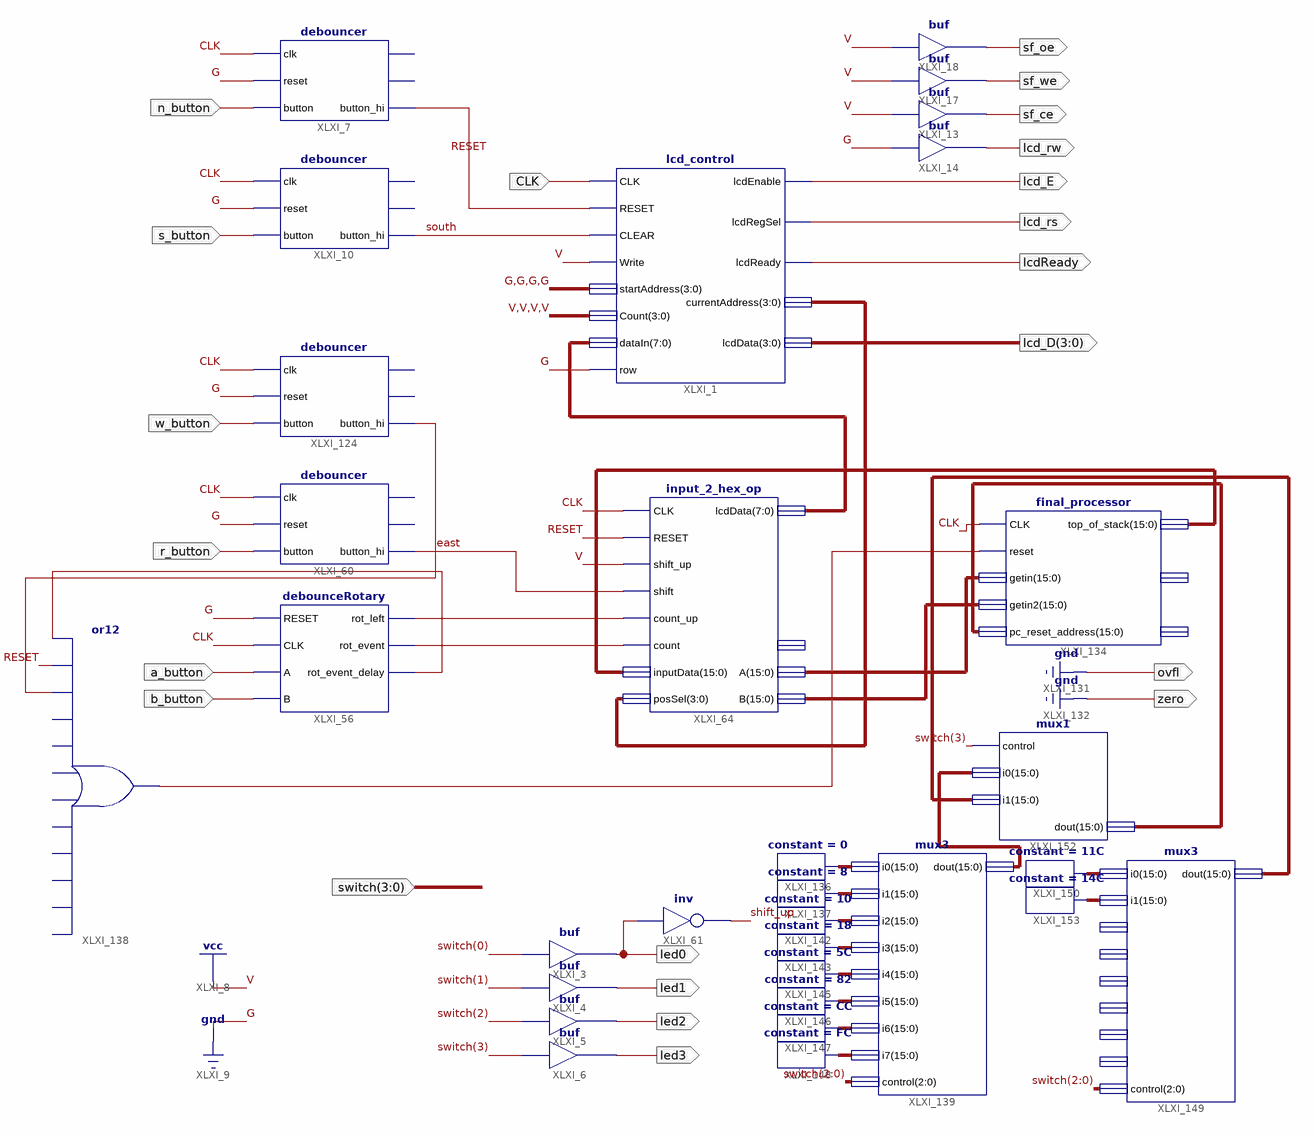
[diagram p0: schematic sheet 1]
// Xilinx ISE schematic aluIO.sch (spartan3e) as structural Verilog: 31 symbols, 22 ports
module aluIO (
  input  CLK,
  input  s_button,
  input  [3:0] switch,
  input  n_button,
  input  a_button,
  input  b_button,
  input  r_button,
  input  w_button,
  output lcdReady,
  output lcd_rs,
  output lcd_E,
  output sf_ce,
  output lcd_rw,
  output sf_we,
  output sf_oe,
  output led1,
  output led0,
  output led2,
  output led3,
  output ovfl,
  output zero,
  output [3:0] lcd_D
);

  wire east, RESET, shift_up, south, XLXN_135, XLXN_136, XLXN_399, XLXN_400, XLXN_406;
  wire [3:0] XLXN_124;
  wire [7:0] XLXN_118;
  wire [15:0] XLXN_147, XLXN_387, XLXN_392, XLXN_396, XLXN_397, XLXN_415, XLXN_416, XLXN_418, XLXN_419,
       XLXN_420, XLXN_421, XLXN_424, XLXN_425, XLXN_426, XLXN_427, XLXN_428;

  buf XLXI_13 (sf_ce, 1'b1);
  buf XLXI_14 (lcd_rw, 1'b0);
  buf XLXI_17 (sf_we, 1'b1);
  buf XLXI_18 (sf_oe, 1'b1);
  lcd_control XLXI_1 (
    .CLK(CLK), .RESET(RESET), .CLEAR(south), .Write(1'b1), .startAddress(4'b0000), .Count(4'b1111),
    .dataIn(XLXN_118), .lcdEnable(lcd_E), .lcdRegSel(lcd_rs), .lcdReady(lcdReady), .currentAddress(XLXN_124),
    .lcdData(lcd_D), .row(1'b0));
  buf XLXI_3 (led0, switch[0]);
  buf XLXI_4 (led1, switch[1]);
  buf XLXI_5 (led2, switch[2]);
  buf XLXI_6 (led3, switch[3]);
  not XLXI_61 (shift_up, led0);
  input_2_hex_op XLXI_64 (
    .count_up(XLXN_135), .CLK(CLK), .RESET(RESET), .shift(east), .shift_up(1'b1), .count(XLXN_136),
    .posSel(XLXN_124), .inputData(XLXN_392), .lcdData(XLXN_118), .A(XLXN_387), .B(XLXN_147));  // open: op
  debouncer XLXI_124 (.clk(CLK), .reset(1'b0), .button(w_button), .button_hi(XLXN_406));  // open: debutton, button_lo
  debouncer XLXI_7 (.clk(CLK), .reset(1'b0), .button(n_button), .button_hi(RESET));  // open: debutton, button_lo
  debouncer XLXI_10 (.clk(CLK), .reset(1'b0), .button(s_button), .button_hi(south));  // open: debutton, button_lo
  debounceRotary XLXI_56 (
    .A(a_button), .B(b_button), .CLK(CLK), .RESET(1'b0), .rot_event(XLXN_136), .rot_event_delay(XLXN_400),
    .rot_left(XLXN_135));
  debouncer XLXI_60 (.clk(CLK), .reset(1'b0), .button(r_button), .button_hi(east));  // open: debutton, button_lo
  final_processor XLXI_134 (
    .CLK(CLK), .reset(XLXN_399), .getin(XLXN_387), .getin2(XLXN_147), .top_of_stack(XLXN_392),
    .pc_reset_address(XLXN_427));  // open: second_of_stack, inst_count
  or XLXI_138 (XLXN_399, XLXN_406, RESET, XLXN_400);  // open: I0, I1, I2, I3, I4, I5, I6, I7, I8
  mux3 XLXI_139 (
    .i0(XLXN_396), .i1(XLXN_397), .i2(XLXN_415), .i3(XLXN_416), .i4(XLXN_418), .i5(XLXN_419), .i6(XLXN_420),
    .i7(XLXN_421), .control(switch[2:0]), .dout(XLXN_425));
  constant #(.CValue("0")) XLXI_136 (.O(XLXN_396));
  constant #(.CValue("8")) XLXI_137 (.O(XLXN_397));
  constant #(.CValue("10")) XLXI_142 (.O(XLXN_415));
  constant #(.CValue("18")) XLXI_143 (.O(XLXN_416));
  constant #(.CValue("5C")) XLXI_145 (.O(XLXN_418));
  constant #(.CValue("82")) XLXI_146 (.O(XLXN_419));
  constant #(.CValue("CC")) XLXI_147 (.O(XLXN_420));
  constant #(.CValue("FC")) XLXI_148 (.O(XLXN_421));
  mux3 XLXI_149 (.i0(XLXN_424), .i1(XLXN_428), .control(switch[2:0]), .dout(XLXN_426));  // open: i2, i3, i4, i5, i6, i7
  constant #(.CValue("11C")) XLXI_150 (.O(XLXN_424));
  mux1 XLXI_152 (.control(switch[3]), .i0(XLXN_425), .i1(XLXN_426), .dout(XLXN_427));
  constant #(.CValue("14C")) XLXI_153 (.O(XLXN_428));

  assign ovfl = 1'b0;
  assign zero = 1'b0;
endmodule
